# Altium schematic sheet m66.SchDoc: m66_bc66
size A4; Author: alireza roozitalab; Organization: Altium Limited; Address1: L3, 12a Rodborough Rd; Address2: Frenchs Forest; Address3: NSW; Address4: Australia 2086
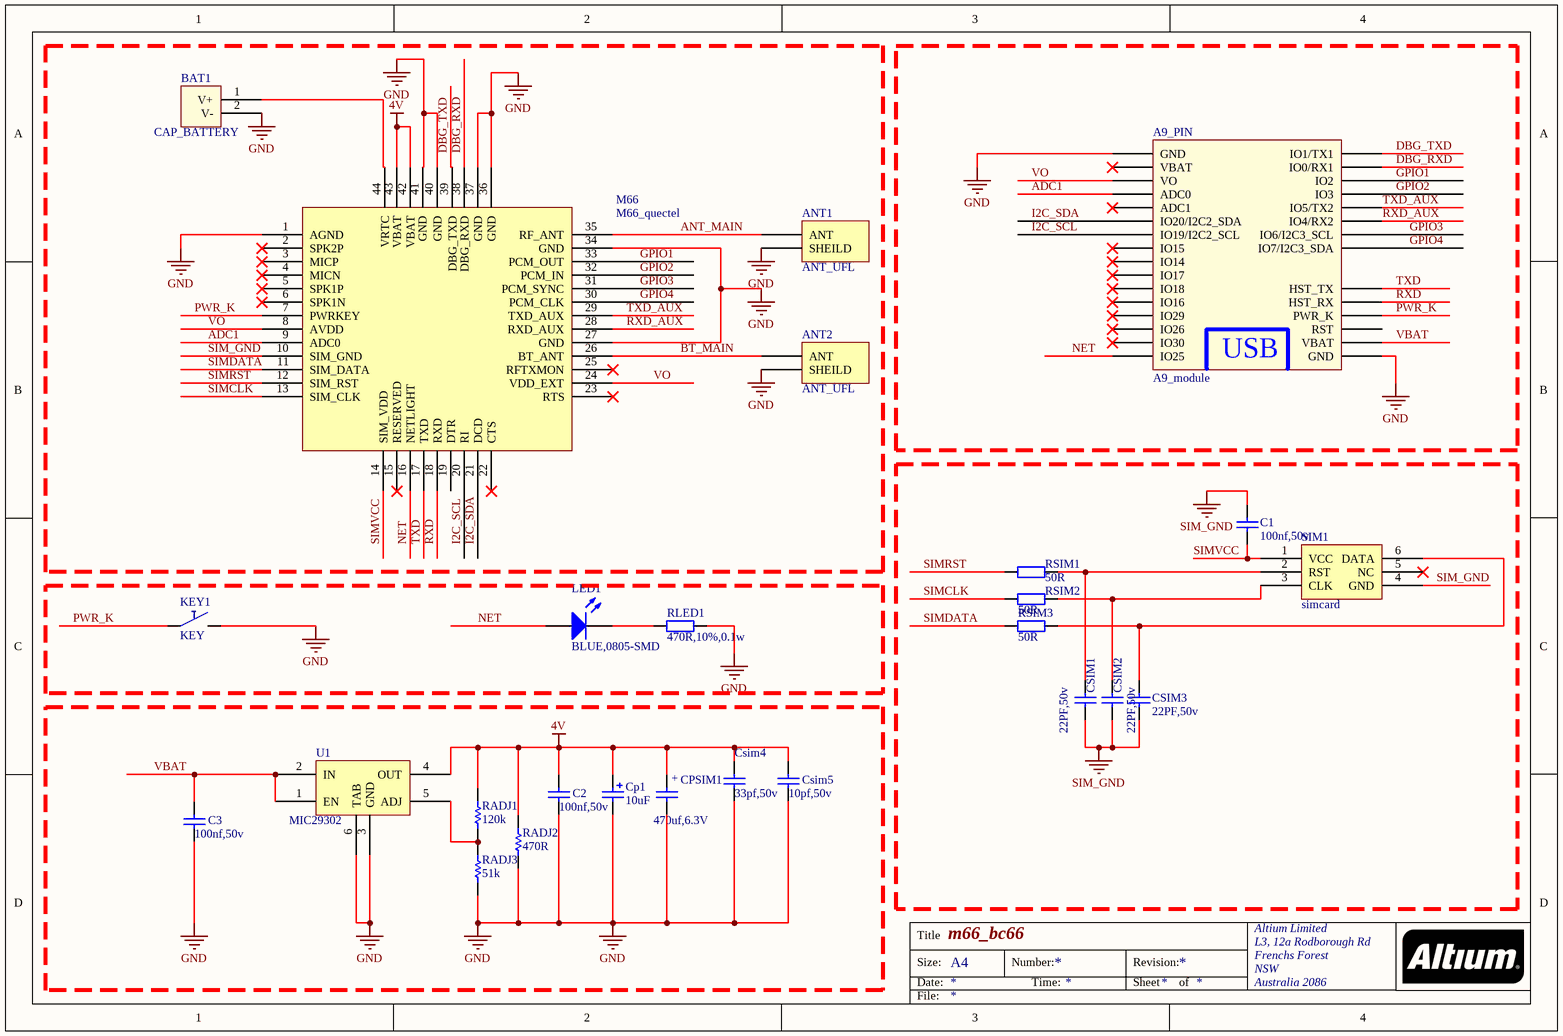
[diagram p0: m66.SchDoc]

## Parts
A9_PIN  A9_module  [A9_MODULE]
ANT1  ANT_UFL  [UFL_CON]
ANT2  ANT_UFL  [UFL_CON]
BAT1  CAP_BATTERY  [CAP_BAT]
C1  100nf,50v  [0805.]
C2  100nf,50v  [0805.]
C3  100nf,50v  [0805.]
Cp1  10uF  [C1206.]
CPSIM1  470uf,6.3V  [MY_SMC_D]
CSIM1  22PF,50v  [0805.]
CSIM2  22PF,50v  [0805.]
CSIM3  22PF,50v  [0805.]
Csim4  33pf,50v  [0805.]
Csim5  10pf,50v  [0805.]
KEY1  KEY  [SMD_KEY]
LED1  BLUE,0805-SMD  [0805.]
M66  M66_quectel  [M66_QUECTEL]
RADJ1  120k  [0805.]
RADJ2  470R  [0805.]
RADJ3  51k  [0805.]
RLED1  470R,10%,0.1w  [0805.]
RSIM1  value 50R  [0805.]  (hidden comment: 47R,10%,0.1w)
RSIM2  value 50R  [0805.]  (hidden comment: 47R,10%,0.1w)
RSIM3  value 50R  [0805.]  (hidden comment: 47R,10%,0.1w)
SIM1  simcard  [SIMCARD_M]
U1  MIC29302  [MIC29302]

## Nets
4V: C2.2 Cp1.1 CPSIM1.+ Csim4.2 Csim5.2 M66.42(VBAT) M66.43(VBAT) RADJ1.2 RADJ2.2 U1.4(OUT)
GND: A9_PIN.1(GND) A9_PIN.17(GND) ANT1.1(SHEILD) ANT2.1(SHEILD) BAT1.2(V-) C2.1 C3.1 Cp1.2 CPSIM1.- Csim4.1 Csim5.1 KEY1.2 M66.1(AGND) M66.27(GND) M66.34(GND) M66.36(GND) M66.37(GND) M66.40(GND) M66.41(GND) RADJ2.1 RADJ3.1 RLED1.2 U1.3(GND) U1.6(TAB)
SIM_GND: C1.2 CSIM1.1 CSIM2.1 CSIM3.1 M66.10(SIM_GND) SIM1.4(GND)
ADC1: A9_PIN.4(ADC0) M66.9(ADC0)
ANT_MAIN: ANT1.2(ANT) M66.35(RF_ANT)
BT_MAIN: ANT2.2(ANT) M66.26(BT_ANT)
DBG_RXD: A9_PIN.29(IO0/RX1) M66.38(DBG_RXD)
DBG_TXD: A9_PIN.30(IO1/TX1) M66.39(DBG_TXD)
GPIO1: A9_PIN.28(IO2) M66.33(PCM_OUT)
GPIO2: A9_PIN.27(IO3) M66.32(PCM_IN)
GPIO3: A9_PIN.24(IO6/I2C3_SCL) M66.31(PCM_SYNC)
GPIO4: A9_PIN.23(IO7/I2C3_SDA) M66.30(PCM_CLK)
I2C_SCL: A9_PIN.7(IO19/I2C2_SCL) M66.20(RI)
I2C_SDA: A9_PIN.6(IO20/I2C2_SDA) M66.21(DCD)
NET: A9_PIN.16(IO25) LED1.2(A) M66.16(NETLIGHT)
PWR_K: A9_PIN.20(PWR_K) KEY1.1 M66.7(PWRKEY)
RXD: A9_PIN.21(HST_RX) M66.18(RXD)
RXD_AUX: A9_PIN.25(IO4/RX2) M66.28(RXD_AUX)
SIMCLK: M66.13(SIM_CLK) RSIM2.1
SIMDATA: M66.11(SIM_DATA) RSIM3.1
SIMRST: M66.12(SIM_RST) RSIM1.1
SIMVCC: C1.1 M66.14(SIM_VDD) SIM1.1(VCC)
TXD: A9_PIN.22(HST_TX) M66.17(TXD)
TXD_AUX: A9_PIN.26(IO5/TX2) M66.29(TXD_AUX)
VBAT: A9_PIN.18(VBAT) C3.2 U1.1(EN) U1.2(IN)
VO: A9_PIN.3(VO) M66.8(AVDD) M66.24(VDD_EXT)
NetBAT1_1: BAT1.1(V+) M66.44(VRTC)
NetCSIM1_2: CSIM1.2 RSIM1.2 SIM1.2(RST)
NetCSIM2_2: CSIM2.2 RSIM2.2 SIM1.3(CLK)
NetCSIM3_2: CSIM3.2 RSIM3.2 SIM1.6(DATA)
NetLED1_1: LED1.1(K) RLED1.1
NetRADJ1_1: RADJ1.1 RADJ3.2 U1.5(ADJ)

Not connected (* = marked no-connect by the designer): A9_PIN 2(VBAT)* 5(ADC1)* 8(IO15)* 9(IO14)* 10(IO17)* 11(IO18)* 12(IO16)* 13(IO29)* 14(IO26)* 15(IO30)* 19(RST); M66 2(SPK2P)* 3(MICP)* 4(MICN)* 5(SPK1P)* 6(SPK1N)* 15(RESERVED)* 19(DTR) 22(CTS)* 23(RTS)* 25(RFTXMON)*; SIM1 5(NC)*

## Notes on the sheet
- Title
- Size:
- Date:
- A4
- Number:
- Time:
- Revision:
- Sheet
- of
- File:
- (in symbol A9_module) USB

## Library data of the parts
C1-C3 CSIM1-CSIM3 Csim4 Csim5 = Cap: Capacitor; Published: 8-Jun-2000; LatestRevisionDate: 17-Jul-2002; LatestRevisionNote: Re-released for DXP Platform.; PackageReference: RAD-0.3; Publisher: Altium Limited
Cp1 = Cap Pol1: Polarized Capacitor (Radial); Published: 8-Jun-2000; Revision: July-2002: Re-released for DXP Platform.; Publisher: Altium Limited; Value: 10uF
CPSIM1 = Cap Pol: Polar capacitor; ASiD Part Number: C-AS; Volte: 35v; Value: 470uf,6.3V
LED1 = LED0: Typical INFRARED GaAs LED; Published: 8-Jun-2000; LatestRevisionDate: 08-Jul-2005; LatestRevisionNote: Mech Layer 1 removed.; PackageReference: LED-0; Publisher: Altium Limited
RADJ1-RADJ3 = Res1: Resistor; Value: 1K; Published: 8-Jun-2000; Revision: July-2002: Re-released for DXP Platform.; Publisher: Altium Limited
RLED1 RSIM1-RSIM3 = Res2: Resistor; Published: 8-Jun-2000; LatestRevisionDate: 17-Jul-2002; LatestRevisionNote: Re-released for DXP Platform.; PackageReference: AXIAL-0.4; Publisher: Altium Limited
  RSIM1-RSIM3: PackageDescription: Axial Device, Thru-Hole; 2 Leads; 0.4 in Pin Spacing